# Altium schematic sheet Pg15_FPGA_5CGX.SchDoc: FPGA CYCLONE III
size A2; DocumentNumber: 15; SheetNumber: 15; SheetTotal: 16
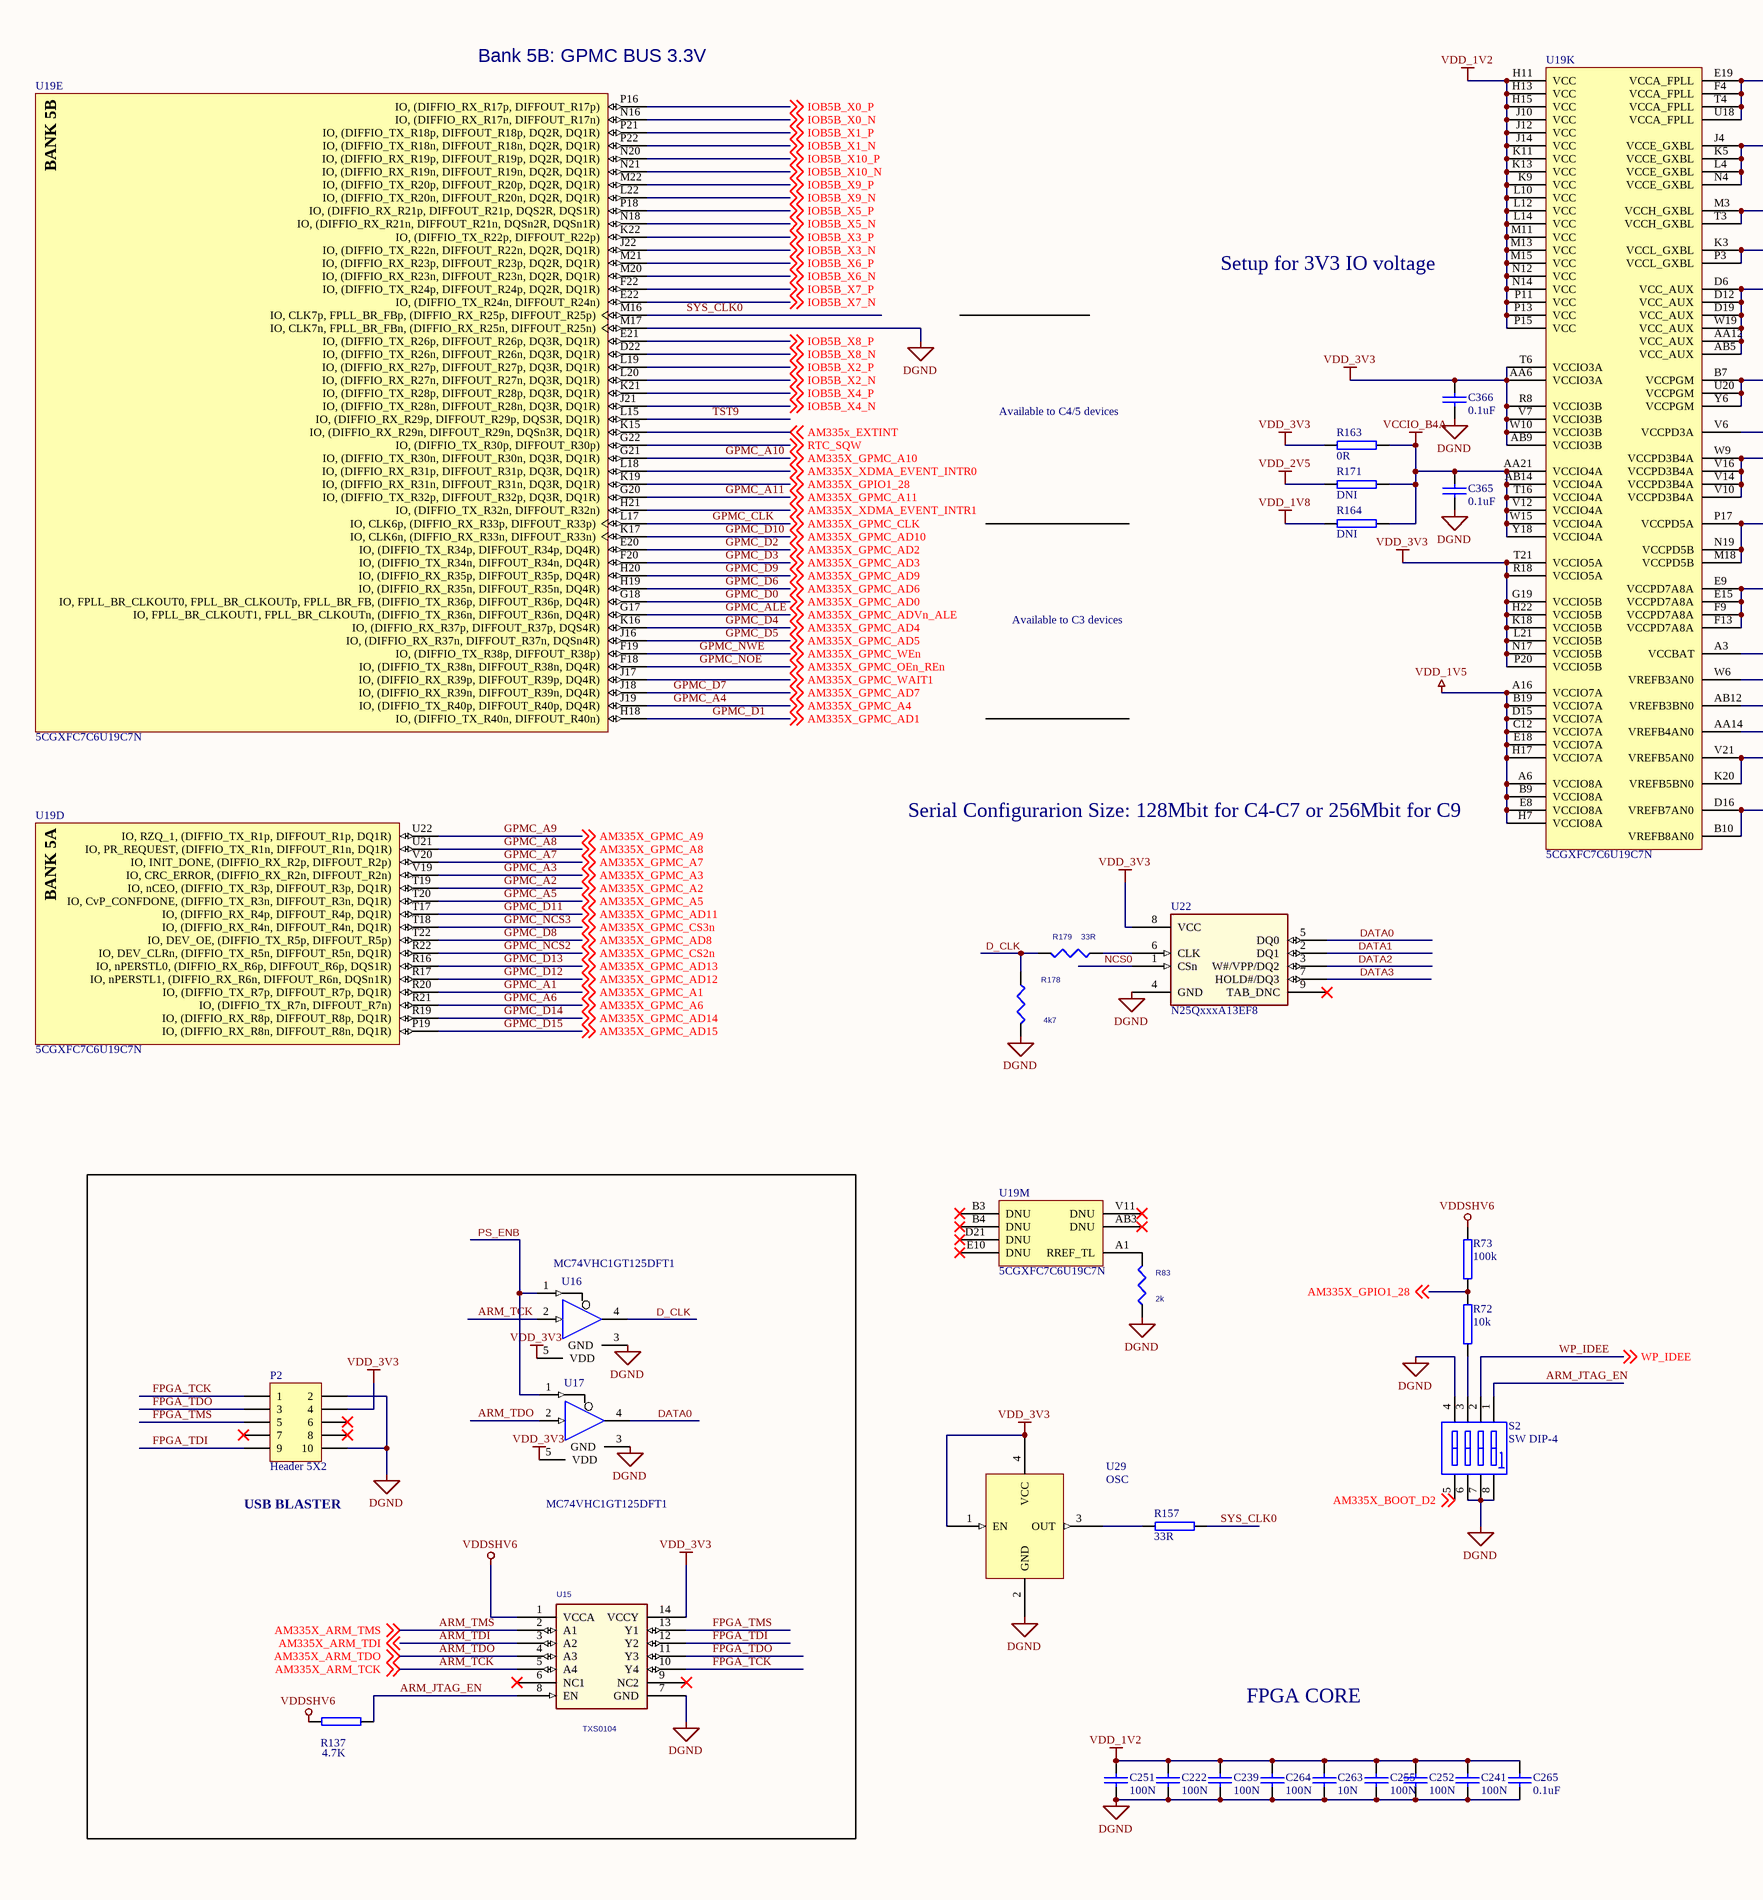
[diagram p0: Pg15_FPGA_5CGX.SchDoc, left]
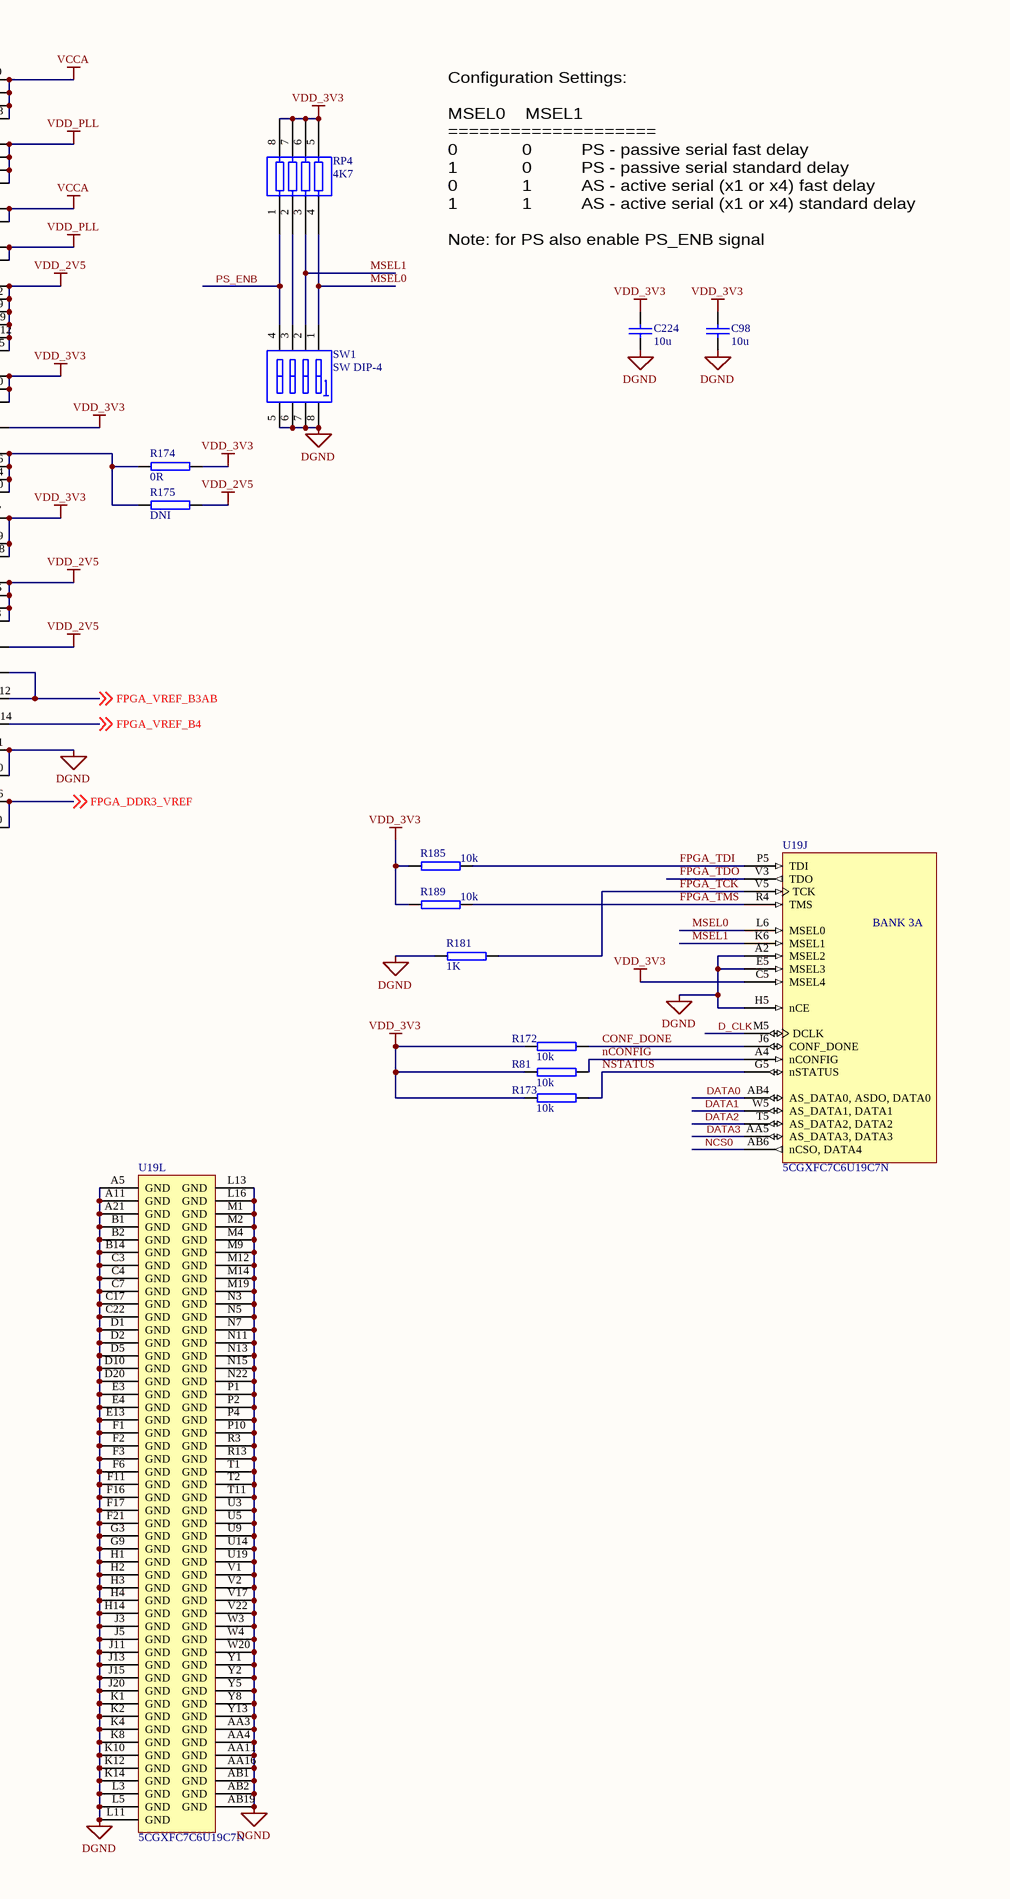
[diagram p1: Pg15_FPGA_5CGX.SchDoc, right]

## Parts
?  (no value)  (graphical)
C98  10u  [0603]
C222  100N  [0603]
C224  10u  [0603]
C239  100N  [sc0402]
C241  100N  [sc0402]
C251  100N  [sc0402]
C252  100N  [sc0402]
C255  100N  [sc0402]
C263  10N  [sc0402]
C264  100N  [sc0402]
C265  0.1uF  [sc0402]
C365  0.1uF  [sc0402]
C366  0.1uF  [sc0402]
P2  Header 5X2  [HDR2X5]
R72  10k  [sc0402]
R73  100k  [sc0402]
R81  10k  [sc0402]
R83  2k  [SM-7351-RES-0402]
R137  4.7K  [sc0402]
R157  33R  [sc0402]
R163  0R  [sc0402]
R164  DNI  [sc0402]
R171  DNI  [sc0402]
R172  10k  [sc0402]
R173  10k  [sc0402]
R174  0R  [sc0402]
R175  DNI  [sc0402]
R178  4k7  [SM-7351-RES-0402]
R179  33R  [SM-7351-RES-0402]
R181  1K  [sc0402]
R185  10k  [sc0402]
R189  10k  [sc0402]
RP4  4K7  [1206X4]
S2  SW DIP-4  [DIPSOP8]
SW1  SW DIP-4  [DIPSOP8]
U15  TXS0104  [RU-14]
U16  MC74VHC1GT125DFT1  [419A-01_N]
U17  MC74VHC1GT125DFT1  [419A-01_N]
U19  5CGXFC7C6U19C7N  [ALTR-UBGA484_A-190]  (parts D,E,J,K,L,M of 13)
U22  N25QxxxA13EF8  [QFN127P600X500X85_HS-9N]
U29  OSC  [Osc 3.2x2.5]

## Blocks framed on the sheet
USB BLASTER: P2 R137 U15-U17

## Nets
DGND: C98.2 C222.2 C224.2 C239.2 C241.2 C251.2 C252.2 C255.2 C263.2 C264.2 C265.2 C365.2 C366.2 P2.2 P2.10 R83.2(P2) R178.1(P1) R181.2 S2.4(A4) S2.6(B3) S2.7(B2) S2.8(B1) SW1.5(B4) SW1.6(B3) SW1.7(B2) SW1.8(B1) U15.7(GND) U16.3(GND) U17.3(GND) U19.A2(MSEL2) U19.A5(GND) U19.A11(GND) U19.A21(GND) U19.AA3(GND) U19.AA4(GND) U19.AA11(GND) U19.AA16(GND) U19.AB1(GND) U19.AB2(GND) U19.AB19(GND) U19.B1(GND) U19.B2(GND) U19.B14(GND) U19.C3(GND) U19.C4(GND) U19.C7(GND) U19.C17(GND) U19.C22(GND) U19.D1(GND) U19.D2(GND) U19.D5(GND) U19.D10(GND) U19.D20(GND) U19.E3(GND) U19.E4(GND) U19.E5(MSEL3) U19.E13(GND) U19.F1(GND) U19.F2(GND) U19.F3(GND) U19.F6(GND) U19.F11(GND) U19.F16(GND) U19.F17(GND) U19.F21(GND) U19.G3(GND) U19.G9(GND) U19.H1(GND) U19.H2(GND) U19.H3(GND) U19.H4(GND) U19.H5(nCE) U19.H14(GND) U19.J3(GND) U19.J5(GND) U19.J11(GND) U19.J13(GND) U19.J15(GND) U19.J20(GND) U19.K1(GND) U19.K2(GND) U19.K4(GND) U19.K8(GND) U19.K10(GND) U19.K12(GND) U19.K14(GND) U19.K20(VREFB5BN0) U19.L3(GND) U19.L5(GND) U19.L11(GND) U19.L13(GND) U19.L16(GND) U19.M1(GND) U19.M2(GND) U19.M4(GND) U19.M9(GND) U19.M12(GND) U19.M14(GND) U19.M17(IO,_CLK7n,_FPLL_BR_FBn,_(DIFFIO_RX_R25n,_DIFFOUT_R25n)) U19.M19(GND) U19.N3(GND) U19.N5(GND) U19.N7(GND) U19.N11(GND) U19.N13(GND) U19.N15(GND) U19.N22(GND) U19.P1(GND) U19.P2(GND) U19.P4(GND) U19.P10(GND) U19.R3(GND) U19.R13(GND) U19.T1(GND) U19.T2(GND) U19.T11(GND) U19.U3(GND) U19.U5(GND) U19.U9(GND) U19.U14(GND) U19.U19(GND) U19.V1(GND) U19.V2(GND) U19.V17(GND) U19.V21(VREFB5AN0) U19.V22(GND) U19.W3(GND) U19.W4(GND) U19.W20(GND) U19.Y1(GND) U19.Y2(GND) U19.Y5(GND) U19.Y8(GND) U19.Y13(GND) U22.4(GND) U29.2(GND)  [also labelled GND]
VCCA: U19.E19(VCCA_FPLL) U19.F4(VCCA_FPLL) U19.M3(VCCH_GXBL) U19.T3(VCCH_GXBL) U19.T4(VCCA_FPLL) U19.U18(VCCA_FPLL)
VCCIO_B4A: C365.1 R163.1 R164.1 R171.1 U19.AA21(VCCIO4A) U19.AB14(VCCIO4A) U19.T16(VCCIO4A) U19.V12(VCCIO4A) U19.W15(VCCIO4A) U19.Y18(VCCIO4A)
VDD: C98.1 C224.1 C366.1 P2.4 R81.2 R163.2 R172.2 R173.2 R174.1 R185.2 R189.2 RP4.5 RP4.6 RP4.7 RP4.8 U15.14(VCCY) U16.5(VDD) U17.5(VDD) U19.AA6(VCCIO3A) U19.AB9(VCCIO3B) U19.B7(VCCPGM) U19.C5(MSEL4) U19.G19(VCCIO5B) U19.H22(VCCIO5B) U19.K18(VCCIO5B) U19.L21(VCCIO5B) U19.M18(VCCPD5B) U19.N17(VCCIO5B) U19.N19(VCCPD5B) U19.P17(VCCPD5A) U19.P20(VCCIO5B) U19.R8(VCCIO3B) U19.R18(VCCIO5A) U19.T6(VCCIO3A) U19.T21(VCCIO5A) U19.U20(VCCPGM) U19.V6(VCCPD3A) U19.V7(VCCIO3B) U19.W10(VCCIO3B) U19.Y6(VCCPGM) U22.8(VCC) U29.1(EN) U29.4(VCC)  [also labelled VDD_3V3]
VDD_1V2: C222.1 C239.1 C241.1 C251.1 C252.1 C255.1 C263.1 C264.1 C265.1 U19.H11(VCC) U19.H13(VCC) U19.H15(VCC) U19.J10(VCC) U19.J12(VCC) U19.J14(VCC) U19.K9(VCC) U19.K11(VCC) U19.K13(VCC) U19.L10(VCC) U19.L12(VCC) U19.L14(VCC) U19.M11(VCC) U19.M13(VCC) U19.M15(VCC) U19.N12(VCC) U19.N14(VCC) U19.P11(VCC) U19.P13(VCC) U19.P15(VCC)
VDD_1V5: U19.A6(VCCIO8A) U19.A16(VCCIO7A) U19.B9(VCCIO8A) U19.B19(VCCIO7A) U19.C12(VCCIO7A) U19.D15(VCCIO7A) U19.E8(VCCIO8A) U19.E18(VCCIO7A) U19.H7(VCCIO8A) U19.H17(VCCIO7A)
VDD_1V8: R164.2
VDD_2V5: R171.2 R175.1 U19.A3(VCCBAT) U19.AA12(VCC_AUX) U19.AB5(VCC_AUX) U19.D6(VCC_AUX) U19.D12(VCC_AUX) U19.D19(VCC_AUX) U19.E9(VCCPD7A8A) U19.E15(VCCPD7A8A) U19.F9(VCCPD7A8A) U19.F13(VCCPD7A8A) U19.W19(VCC_AUX)
VDD_PLL: U19.J4(VCCE_GXBL) U19.K3(VCCL_GXBL) U19.K5(VCCE_GXBL) U19.L4(VCCE_GXBL) U19.N4(VCCE_GXBL) U19.P3(VCCL_GXBL)
VDDSHV6: R73.2 R137.2 U15.1(VCCA)
AM335X_BOOT_D2: S2.5(B4) ; off-sheet AM335X_BOOT_D2
AM335x_EXTINT: U19.K15(IO,_(DIFFIO_RX_R29n,_DIFFOUT_R29n,_DQSn3R,_DQ1R)) ; off-sheet AM335x_EXTINT
AM335X_GPIO1_28: R72.2 R73.1 U19.K19(IO,_(DIFFIO_RX_R31n,_DIFFOUT_R31n,_DQ3R,_DQ1R)) ; off-sheet AM335X_GPIO1_28
AM335X_GPMC_WAIT1: U19.J17(IO,_(DIFFIO_RX_R39p,_DIFFOUT_R39p,_DQ4R)) ; off-sheet AM335X_GPMC_WAIT1
AM335X_XDMA_EVENT_INTR0: U19.L18(IO,_(DIFFIO_RX_R31p,_DIFFOUT_R31p,_DQ3R,_DQ1R)) ; off-sheet AM335X_XDMA_EVENT_INTR0
AM335X_XDMA_EVENT_INTR1: U19.H21(IO,_(DIFFIO_TX_R32n,_DIFFOUT_R32n)) ; off-sheet AM335X_XDMA_EVENT_INTR1
ARM_JTAG_EN: R137.1 S2.1(A1) U15.8(EN)
ARM_TCK: U15.5(A4) U16.2(A) ; off-sheet AM335X_ARM_TCK  [also labelled AM335X_ARM_TCK]
ARM_TDI: U15.3(A2) ; off-sheet AM335X_ARM_TDI  [also labelled AM335X_ARM_TDI]
ARM_TDO: U15.4(A3) U17.2(A) ; off-sheet AM335X_ARM_TDO  [also labelled AM335X_ARM_TDO]
ARM_TMS: U15.2(A1) ; off-sheet AM335X_ARM_TMS  [also labelled AM335X_ARM_TMS]
CONF_DONE: R172.1 U19.J6(CONF_DONE)
D_CLK: R178.2(P2) R179.1(P1) U16.4(Y) U19.M5(DCLK)
DATA0: U17.4(Y) U19.AB4(AS_DATA0,_ASDO,_DATA0) U22.5(DQ0)
DATA1: U19.W5(AS_DATA1,_DATA1) U22.2(DQ1)
DATA2: U19.T5(AS_DATA2,_DATA2) U22.3(W#/VPP/DQ2)
DATA3: U19.AA5(AS_DATA3,_DATA3) U22.7(HOLD#/DQ3)
FPGA_DDR3_VREF: U19.B10(VREFB8AN0) U19.D16(VREFB7AN0) ; off-sheet FPGA_DDR3_VREF
FPGA_TCK: P2.1 R181.1 U15.10(Y4) U19.V5(TCK)
FPGA_TDI: P2.9 R185.1 U15.12(Y2) U19.P5(TDI)
FPGA_TDO: P2.3 U15.11(Y3) U19.V3(TDO)
FPGA_TMS: P2.5 R189.1 U15.13(Y1) U19.R4(TMS)
FPGA_VREF_B3AB: U19.AB12(VREFB3BN0) U19.W6(VREFB3AN0) ; off-sheet FPGA_VREF_B3AB
FPGA_VREF_B4: U19.AA14(VREFB4AN0) ; off-sheet FPGA_VREF_B4
GPMC_A1: U19.R20(IO,_(DIFFIO_TX_R7p,_DIFFOUT_R7p,_DQ1R)) ; off-sheet AM335X_GPMC_A1  [also labelled AM335X_GPMC_A1]
GPMC_A2: U19.T19(IO,_nCEO,_(DIFFIO_TX_R3p,_DIFFOUT_R3p,_DQ1R)) ; off-sheet AM335X_GPMC_A2  [also labelled AM335X_GPMC_A2]
GPMC_A3: U19.V19(IO,_CRC_ERROR,_(DIFFIO_RX_R2n,_DIFFOUT_R2n)) ; off-sheet AM335X_GPMC_A3  [also labelled AM335X_GPMC_A3]
GPMC_A4: U19.J19(IO,_(DIFFIO_TX_R40p,_DIFFOUT_R40p,_DQ4R)) ; off-sheet AM335X_GPMC_A4  [also labelled AM335X_GPMC_A4]
GPMC_A5: U19.T20(IO,_CvP_CONFDONE,_(DIFFIO_TX_R3n,_DIFFOUT_R3n,_DQ1R)) ; off-sheet AM335X_GPMC_A5  [also labelled AM335X_GPMC_A5]
GPMC_A6: U19.R21(IO,_(DIFFIO_TX_R7n,_DIFFOUT_R7n)) ; off-sheet AM335X_GPMC_A6  [also labelled AM335X_GPMC_A6]
GPMC_A7: U19.V20(IO,_INIT_DONE,_(DIFFIO_RX_R2p,_DIFFOUT_R2p)) ; off-sheet AM335X_GPMC_A7  [also labelled AM335X_GPMC_A7]
GPMC_A8: U19.U21(IO,_PR_REQUEST,_(DIFFIO_TX_R1n,_DIFFOUT_R1n,_DQ1R)) ; off-sheet AM335X_GPMC_A8  [also labelled AM335X_GPMC_A8]
GPMC_A9: U19.U22(IO,_RZQ_1,_(DIFFIO_TX_R1p,_DIFFOUT_R1p,_DQ1R)) ; off-sheet AM335X_GPMC_A9  [also labelled AM335X_GPMC_A9]
GPMC_A10: U19.G21(IO,_(DIFFIO_TX_R30n,_DIFFOUT_R30n,_DQ3R,_DQ1R)) ; off-sheet AM335X_GPMC_A10  [also labelled AM335X_GPMC_A10]
GPMC_A11: U19.G20(IO,_(DIFFIO_TX_R32p,_DIFFOUT_R32p,_DQ3R,_DQ1R)) ; off-sheet AM335X_GPMC_A11  [also labelled AM335X_GPMC_A11]
GPMC_ALE: U19.G17(IO,_FPLL_BR_CLKOUT1,_FPLL_BR_CLKOUTn,_(DIFFIO_TX_R36n,_DIFFOUT_R36n,_DQ4R)) ; off-sheet AM335X_GPMC_ADVn_ALE  [also labelled AM335X_GPMC_ADVn_ALE]
GPMC_CLK: U19.L17(IO,_CLK6p,_(DIFFIO_RX_R33p,_DIFFOUT_R33p)) ; off-sheet AM335X_GPMC_CLK  [also labelled AM335X_GPMC_CLK]
GPMC_D0: U19.G18(IO,_FPLL_BR_CLKOUT0,_FPLL_BR_CLKOUTp,_FPLL_BR_FB,_(DIFFIO_TX_R36p,_DIFFOUT_R36p,_DQ4R)) ; off-sheet AM335X_GPMC_AD0  [also labelled AM335X_GPMC_AD0]
GPMC_D1: U19.H18(IO,_(DIFFIO_TX_R40n,_DIFFOUT_R40n)) ; off-sheet AM335X_GPMC_AD1  [also labelled AM335X_GPMC_AD1]
GPMC_D2: U19.E20(IO,_(DIFFIO_TX_R34p,_DIFFOUT_R34p,_DQ4R)) ; off-sheet AM335X_GPMC_AD2  [also labelled AM335X_GPMC_AD2]
GPMC_D3: U19.F20(IO,_(DIFFIO_TX_R34n,_DIFFOUT_R34n,_DQ4R)) ; off-sheet AM335X_GPMC_AD3  [also labelled AM335X_GPMC_AD3]
GPMC_D4: U19.K16(IO,_(DIFFIO_RX_R37p,_DIFFOUT_R37p,_DQS4R)) ; off-sheet AM335X_GPMC_AD4  [also labelled AM335X_GPMC_AD4]
GPMC_D5: U19.J16(IO,_(DIFFIO_RX_R37n,_DIFFOUT_R37n,_DQSn4R)) ; off-sheet AM335X_GPMC_AD5  [also labelled AM335X_GPMC_AD5]
GPMC_D6: U19.H19(IO,_(DIFFIO_RX_R35n,_DIFFOUT_R35n,_DQ4R)) ; off-sheet AM335X_GPMC_AD6  [also labelled AM335X_GPMC_AD6]
GPMC_D7: U19.J18(IO,_(DIFFIO_RX_R39n,_DIFFOUT_R39n,_DQ4R)) ; off-sheet AM335X_GPMC_AD7  [also labelled AM335X_GPMC_AD7]
GPMC_D8: U19.T22(IO,_DEV_OE,_(DIFFIO_TX_R5p,_DIFFOUT_R5p)) ; off-sheet AM335X_GPMC_AD8  [also labelled AM335X_GPMC_AD8]
GPMC_D9: U19.H20(IO,_(DIFFIO_RX_R35p,_DIFFOUT_R35p,_DQ4R)) ; off-sheet AM335X_GPMC_AD9  [also labelled AM335X_GPMC_AD9]
GPMC_D10: U19.K17(IO,_CLK6n,_(DIFFIO_RX_R33n,_DIFFOUT_R33n)) ; off-sheet AM335X_GPMC_AD10  [also labelled AM335X_GPMC_AD10]
GPMC_D11: U19.T17(IO,_(DIFFIO_RX_R4p,_DIFFOUT_R4p,_DQ1R)) ; off-sheet AM335X_GPMC_AD11  [also labelled AM335X_GPMC_AD11]
GPMC_D12: U19.R17(IO,_nPERSTL1,_(DIFFIO_RX_R6n,_DIFFOUT_R6n,_DQSn1R)) ; off-sheet AM335X_GPMC_AD12  [also labelled AM335X_GPMC_AD12]
GPMC_D13: U19.R16(IO,_nPERSTL0,_(DIFFIO_RX_R6p,_DIFFOUT_R6p,_DQS1R)) ; off-sheet AM335X_GPMC_AD13  [also labelled AM335X_GPMC_AD13]
GPMC_D14: U19.R19(IO,_(DIFFIO_RX_R8p,_DIFFOUT_R8p,_DQ1R)) ; off-sheet AM335X_GPMC_AD14  [also labelled AM335X_GPMC_AD14]
GPMC_D15: U19.P19(IO,_(DIFFIO_RX_R8n,_DIFFOUT_R8n,_DQ1R)) ; off-sheet AM335X_GPMC_AD15  [also labelled AM335X_GPMC_AD15]
GPMC_NCS2: U19.R22(IO,_DEV_CLRn,_(DIFFIO_TX_R5n,_DIFFOUT_R5n,_DQ1R)) ; off-sheet AM335X_GPMC_CS2n  [also labelled AM335X_GPMC_CS2n]
GPMC_NCS3: U19.T18(IO,_(DIFFIO_RX_R4n,_DIFFOUT_R4n,_DQ1R)) ; off-sheet AM335X_GPMC_CS3n  [also labelled AM335X_GPMC_CS3n]
GPMC_NOE: U19.F18(IO,_(DIFFIO_TX_R38n,_DIFFOUT_R38n,_DQ4R)) ; off-sheet AM335X_GPMC_OEn_REn  [also labelled AM335X_GPMC_OEn_REn]
GPMC_NWE: U19.F19(IO,_(DIFFIO_TX_R38p,_DIFFOUT_R38p)) ; off-sheet AM335X_GPMC_WEn  [also labelled AM335X_GPMC_WEn]
IOB5B_X0_N: U19.N16(IO,_(DIFFIO_RX_R17n,_DIFFOUT_R17n)) ; off-sheet IOB5B_X0_N
IOB5B_X0_P: U19.P16(IO,_(DIFFIO_RX_R17p,_DIFFOUT_R17p)) ; off-sheet IOB5B_X0_P
IOB5B_X1_N: U19.P22(IO,_(DIFFIO_TX_R18n,_DIFFOUT_R18n,_DQ2R,_DQ1R)) ; off-sheet IOB5B_X1_N
IOB5B_X1_P: U19.P21(IO,_(DIFFIO_TX_R18p,_DIFFOUT_R18p,_DQ2R,_DQ1R)) ; off-sheet IOB5B_X1_P
IOB5B_X2_N: U19.L20(IO,_(DIFFIO_RX_R27n,_DIFFOUT_R27n,_DQ3R,_DQ1R)) ; off-sheet IOB5B_X2_N
IOB5B_X2_P: U19.L19(IO,_(DIFFIO_RX_R27p,_DIFFOUT_R27p,_DQ3R,_DQ1R)) ; off-sheet IOB5B_X2_P
IOB5B_X3_N: U19.J22(IO,_(DIFFIO_TX_R22n,_DIFFOUT_R22n,_DQ2R,_DQ1R)) ; off-sheet IOB5B_X3_N
IOB5B_X3_P: U19.K22(IO,_(DIFFIO_TX_R22p,_DIFFOUT_R22p)) ; off-sheet IOB5B_X3_P
IOB5B_X4_N: U19.J21(IO,_(DIFFIO_TX_R28n,_DIFFOUT_R28n,_DQ3R,_DQ1R)) ; off-sheet IOB5B_X4_N
IOB5B_X4_P: U19.K21(IO,_(DIFFIO_TX_R28p,_DIFFOUT_R28p,_DQ3R,_DQ1R)) ; off-sheet IOB5B_X4_P
IOB5B_X5_N: U19.N18(IO,_(DIFFIO_RX_R21n,_DIFFOUT_R21n,_DQSn2R,_DQSn1R)) ; off-sheet IOB5B_X5_N
IOB5B_X5_P: U19.P18(IO,_(DIFFIO_RX_R21p,_DIFFOUT_R21p,_DQS2R,_DQS1R)) ; off-sheet IOB5B_X5_P
IOB5B_X6_N: U19.M20(IO,_(DIFFIO_RX_R23n,_DIFFOUT_R23n,_DQ2R,_DQ1R)) ; off-sheet IOB5B_X6_N
IOB5B_X6_P: U19.M21(IO,_(DIFFIO_RX_R23p,_DIFFOUT_R23p,_DQ2R,_DQ1R)) ; off-sheet IOB5B_X6_P
IOB5B_X7_N: U19.E22(IO,_(DIFFIO_TX_R24n,_DIFFOUT_R24n)) ; off-sheet IOB5B_X7_N
IOB5B_X7_P: U19.F22(IO,_(DIFFIO_TX_R24p,_DIFFOUT_R24p,_DQ2R,_DQ1R)) ; off-sheet IOB5B_X7_P
IOB5B_X8_N: U19.D22(IO,_(DIFFIO_TX_R26n,_DIFFOUT_R26n,_DQ3R,_DQ1R)) ; off-sheet IOB5B_X8_N
IOB5B_X8_P: U19.E21(IO,_(DIFFIO_TX_R26p,_DIFFOUT_R26p,_DQ3R,_DQ1R)) ; off-sheet IOB5B_X8_P
IOB5B_X9_N: U19.L22(IO,_(DIFFIO_TX_R20n,_DIFFOUT_R20n,_DQ2R,_DQ1R)) ; off-sheet IOB5B_X9_N
IOB5B_X9_P: U19.M22(IO,_(DIFFIO_TX_R20p,_DIFFOUT_R20p,_DQ2R,_DQ1R)) ; off-sheet IOB5B_X9_P
IOB5B_X10_N: U19.N21(IO,_(DIFFIO_RX_R19n,_DIFFOUT_R19n,_DQ2R,_DQ1R)) ; off-sheet IOB5B_X10_N
IOB5B_X10_P: U19.N20(IO,_(DIFFIO_RX_R19p,_DIFFOUT_R19p,_DQ2R,_DQ1R)) ; off-sheet IOB5B_X10_P
MSEL0: RP4.4 SW1.1(A1) U19.L6(MSEL0)
MSEL1: RP4.3 SW1.2(A2) U19.K6(MSEL1)
nCONFIG: R81.1 U19.A4(nCONFIG)
NCS0: U19.AB6(nCSO,_DATA4) U22.1(CSn)
NSTATUS: R173.1 U19.G5(nSTATUS)
PS_ENB: RP4.1 SW1.4(A4) U16.1(~{OE}) U17.1(~{OE})
RTC_SQW: U19.G22(IO,_(DIFFIO_TX_R30p,_DIFFOUT_R30p)) ; off-sheet RTC_SQW
SYS_CLK0: R157.2 U19.M16(IO,_CLK7p,_FPLL_BR_FBp,_(DIFFIO_RX_R25p,_DIFFOUT_R25p))
TST9: U19.L15(IO,_(DIFFIO_RX_R29p,_DIFFOUT_R29p,_DQS3R,_DQ1R))
WP_IDEE: S2.2(A2) ; off-sheet WP_IDEE
NetR72_1: R72.1 S2.3(A3)
NetR83_1: R83.1(P1) U19.A1(RREF_TL)
NetR157_1: R157.1 U29.3(OUT)
NetR174_2: R174.2 R175.2 U19.V10(VCCPD3B4A) U19.V14(VCCPD3B4A) U19.V16(VCCPD3B4A) U19.W9(VCCPD3B4A)
NetR179_2: R179.2(P2) U22.6(CLK)
NetRP4_2: RP4.2 SW1.3(A3)

Not connected (* = marked no-connect by the designer): P2 6* 7* 8*; U15 6(NC1)* 9(NC2)*; U19 AB3(DNU)* B3(DNU)* B4(DNU)* D21(DNU)* E10(DNU)* V11(DNU)*; U22 9(TAB_DNC)*

## Notes on the sheet
- (near U19) Bank 5B: GPMC BUS 3.3V
- Setup for 3V3 IO voltage
- Configuration Settings:
  MSEL0    MSEL1
  ====================
  0             0          PS - passive serial fast delay
  1             0          PS - passive serial standard delay
  0             1          AS - active serial (x1 or x4) fast delay
  1             1          AS - active serial (x1 or x4) standard delay
  Note: for PS also enable PS_ENB signal
- Available to C4/5 devices
- Available to C3 devices
- (near U19) Serial Configurarion Size: 128Mbit for C4-C7 or 256Mbit for C9
- BANK 3A
- FPGA CORE
- Embedded Vision Systems Group
- Title
- School of Electrical and Electronic Engineering
- Date:
- Size
- Document Number
- Sheet
- of
- Rev
- (in symbol 5CGXFC7C6U19C7N, part D) BANK 5A
- (in symbol 5CGXFC7C6U19C7N, part E) BANK 5B

## Library data of the parts
? = Title Block Address(1): UoM title block
C98 C222 C224 C239 C241 C251 C252 C255 C263-C265 C365 C366 = CAP: NON-POLARISED CAP
P2 = Header 5X2: Header, 5-Pin, Dual row; LatestRevisionDate: 17-Jul-2002; LatestRevisionNote: Re-released for DXP Platform.; Publisher: Altium Limited
R72 R73 R81 R157 R163 R164 R171-R175 R181 R185 R189 = RES: Resistor
R83 R178 R179 = 10KOhmResistor1/16W0402: Resistor 10Kohm 1/16W 5% 0402; PartName: 10Kohm1/16W5%SMD0402; Mfr: Rohm; MfrNum: MCR01MZPJ103; TIIntPartnumber: 1R0168; Vendor: DIGIKEY; Cost100: 0.03; Cost10K: 0.0017; DescriptiveText: Resistor 10Kohm 1/16W 5% 0402; Descriptive_Text: Resistor 10Kohm 1/16W 5% 0402
R137 = RES: RESISTOR
RP4 = RESDIP4: QUAD DIP RESISTOR PACK; Part Field 1: 1; Part Field 10: 1000u; Part Field 2: 0; Part Field 3: 0; Part Field 4: 0; Part Field 5: 1; Part Field 6: 1000K; Part Field 7: 1u; Part Field 8: 1u; Part Field 9: 500u
S2 SW1 = SW DIP-4: DIP Switch, 4 Position, SPST; Published: 24-Mar-1999; LatestRevisionDate: 29-May-2009; LatestRevisionNote: IPC-7351 Footprint Added.; PackageReference: SO8; Publisher: Altium Limited; Code_JEDEC: MS-012-AA; Code_IPC: SOIC127P600-8; PackageVersion: Dec-2002; PackageDescription: 8-Pin Small Outline Integrated Circuit 1.27 mm Pitch
U15 = ADG3304: IC - LOW VOLTAGE 1.2 V TO 5.5 V, 4 CHANNEL, BIDIRECTIONAL, LOGIC LEVEL TRANSLATOR, 14-TSSOP; Manufacturer Part Num: ADG3304BRUZ; Manufacturer: Analog Devices; Item Num: P01-14850R; Lead Free Status: Yew
U16 U17 = MC74VHC1GT125DFT1: Non-Inverting Buffer / CMOS Logic Level Shifter with LSTTL-Compatible Inputs; Published: 15-Apr-2002; LatestRevisionDate: 12-Dec-2006; LatestRevisionNote: IPC-7351 Footprint Added.; DatasheetVersion: Feb-2000; PackageVersion: Oct-1999; PackageReference: 419A-01; Publisher: Altium Limited; PackageDescription: 5-Pin SOT-353 Package 0.65 mm Pitch, 2.1 mm Lead Span; ComponentLink1Description: Manufacturer Link; ComponentLink1URL: http://www.onsemi.com/
U19 = 5CGXFC7C6U19C7N: Cyclone V GX Family FPGA, 1.07 to 1.13 V Supply, 240 I/O Pins, 7 PLLs, 484-Pin UBGA, Speed Grade 7, Commercial Grade, RoHS Compliant; Manufacturer: Altera; GPIO: 240; Logic Elements (LE) (K): 149.5; Speed Grade: 7; DatasheetVersion: Rev. 3.4; PackageVersion: Rev. 1.0, 12/2011; PackageReference: UBGA484_A-190; PackageDescription: 484-Pin Ultra FineLine Ball-Grid Array (UBGA), Body 19 x 19 mm, Pitch 0.8 mm; Supplier 1: Digi-Key; Supplier Part Number 1: 5CGXFC7C6U19C7N-ND; Supplier 2: Mouser; Supplier Part Number 2: 989-5CGXFC7C6U19C7N; Device Group: 5CGXFC7; RoHS: RoHS Compliant; Subcategory: Cyclone V GX; Voltage Supply: 1.07 to 1.13 V; NexusDeviceID: 5CGXFC7C6U19C7N; Mounting Technology: Surface Mount; Code_JEDEC: MO-275-PPAA-2; PartNumber: 5CGXFC7C6U19C7N; ComponentLink1Description: Manufacturer URL; ComponentLink1URL: http://www.altera.com; ComponentLink2Description: Datasheet; ComponentLink2URL: http://www.altera.com/literature/hb/cyclone-v/cv_51002.pdf; ComponentLink3Description: Package Specification; ComponentLink3URL: http://www.altera.com/devicepackaging/04R00436-01.pdf; ComponentLink4Description: Device Handbook URL; ComponentLink4URL: http://www.altera.com/literature/hb/cyclone-v/cyclone5_handbook.pdf; ComponentLink5Description: Device Pin-Out URL; ComponentLink5URL: http://www.altera.com/literature/dp/cyclone-v/5CGXFC7.xls; ComponentLink6Description: Device Overview URL; ComponentLink6URL: http://www.altera.com/literature/hb/cyclone-v/cv_51001.pdf; ComponentLink7Description: Product URL; ComponentLink7URL: http://www.buyaltera.com/scripts/partsearch.dll?Detail&name=5CGXFC7C6U19C7N-ND
U29 = OSC: XTAL OSCILLATOR MODULE